# Altium schematic sheet MCU.SchDoc
size A4; SheetNumber: 2; SheetTotal: 10
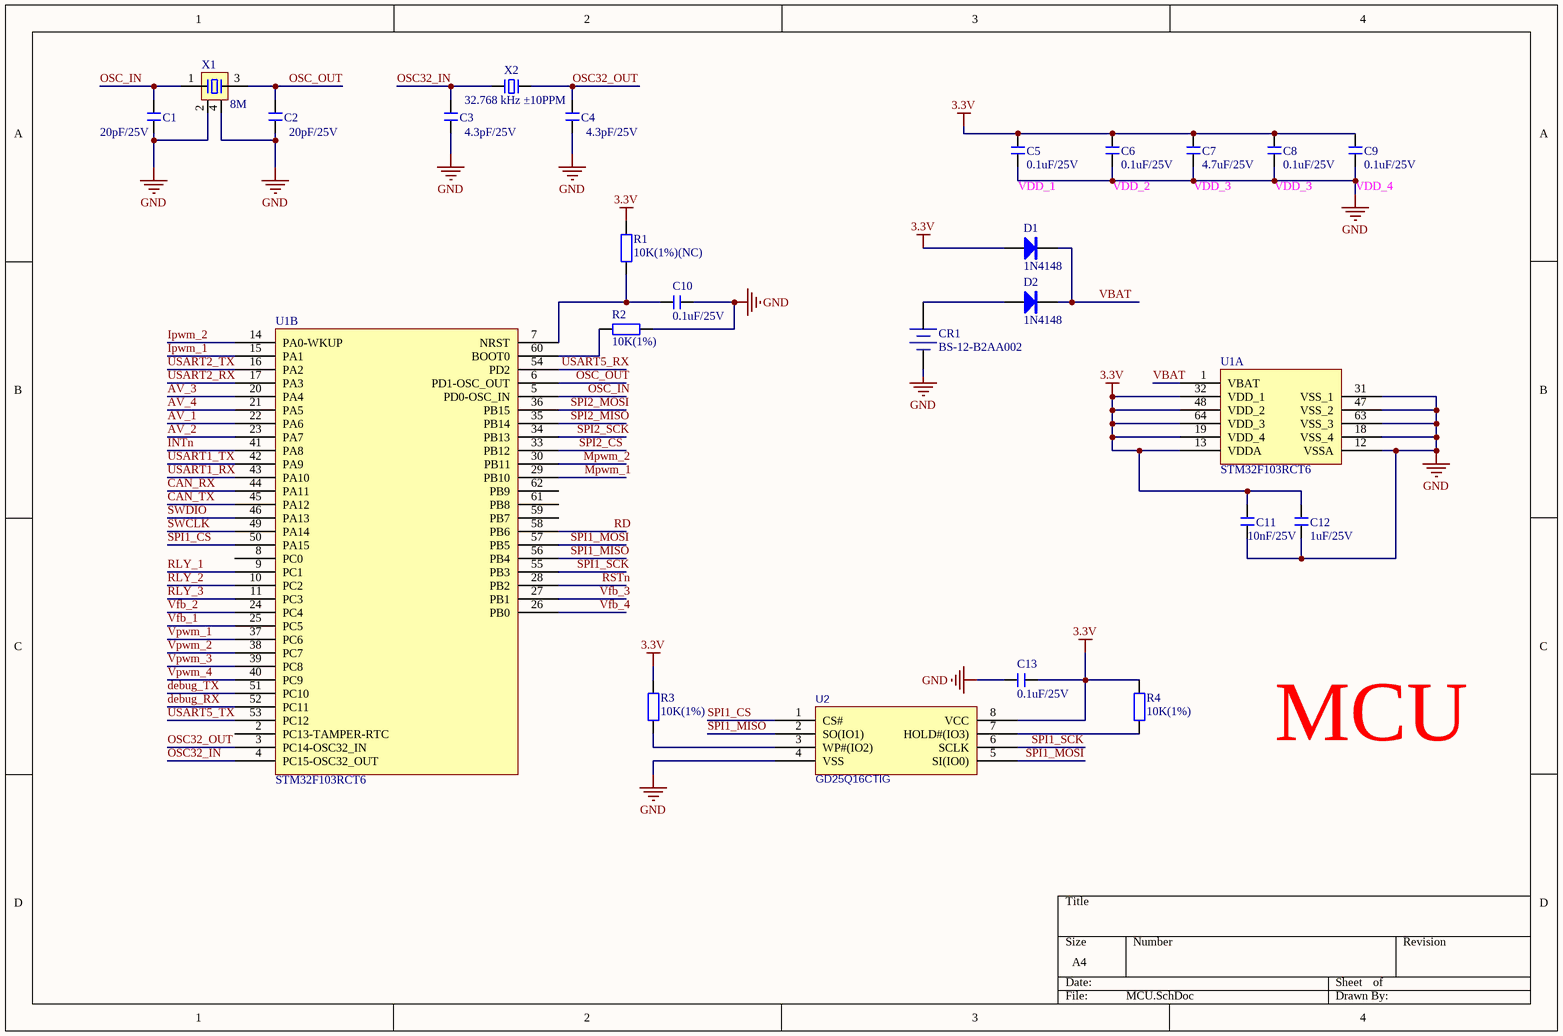
[diagram p0: MCU.SchDoc]

## Parts
C1  20pF/25V  [C 0603_L]
C2  20pF/25V  [C 0603_L]
C3  4.3pF/25V  [C 0603_L]
C4  4.3pF/25V  [C 0603_L]
C5  0.1uF/25V  [C 0603_L]
C6  0.1uF/25V  [C 0603_L]
C7  4.7uF/25V  [C 0603_L]
C8  0.1uF/25V  [C 0603_L]
C9  0.1uF/25V  [C 0603_L]
C10  0.1uF/25V  [C 0603_L]
C11  10nF/25V  [C 0603_L]
C12  1uF/25V  [C 0603_L]
C13  0.1uF/25V  [C 0603_L]
CR1  BS-12-B2AA002  [CR1220_B]
D1  1N4148  [SOD-323]
D2  1N4148  [SOD-323]
R1  10K(1%)(NC)  [R 0603_L]
R2  10K(1%)  [R 0603_L]
R3  10K(1%)  [R 0603_L]
R4  10K(1%)  [R 0603_L]
U1  STM32F103RCT6  [LQFP64 10x10_N]  (parts A,B of 2)
U2  GD25Q16CTIG  [SOP-8]
X1  8M  [OSC 3225-4P]
X2  32.768 kHz ±10PPM  [OSC 3215-2P]

## Nets
3.3V: C5.2 C6.2 C7.2 C8.2 C9.2 C11.1 C12.1 C13.2 D1.1(A) R1.2 R3.1 R4.1 U1.13(VDDA) U1.19(VDD_4) U1.32(VDD_1) U1.48(VDD_2) U1.64(VDD_3) U2.8(VCC)
GND: C1.2 C2.2 C3.2 C4.2 C5.1 C6.1 C7.1 C8.1 C9.1 C10.1 C11.2 C12.2 C13.1 CR1.2(DC-) R2.1 U1.12(VSSA) U1.18(VSS_4) U1.31(VSS_1) U1.47(VSS_2) U1.63(VSS_3) U2.4(VSS) X1.2 X1.4
AV_1: U1.22(PA6)
AV_2: U1.23(PA7)
AV_3: U1.20(PA4)
AV_4: U1.21(PA5)
CAN_RX: U1.44(PA11)
CAN_TX: U1.45(PA12)
debug_RX: U1.52(PC11)
debug_TX: U1.51(PC10)
INTn: U1.41(PA8)
Ipwm_1: U1.15(PA1)
Ipwm_2: U1.14(PA0-WKUP)
Mpwm_1: U1.29(PB10)
Mpwm_2: U1.30(PB11)
OSC32_IN: C3.1 U1.4(PC15-OSC32_OUT) X2.1
OSC32_OUT: C4.1 U1.3(PC14-OSC32_IN) X2.2
OSC_IN: C1.1 U1.5(PD0-OSC_IN) X1.1
OSC_OUT: C2.1 U1.6(PD1-OSC_OUT) X1.3
RD: U1.58(PB6)
RLY_1: U1.9(PC1)
RLY_2: U1.10(PC2)
RLY_3: U1.11(PC3)
RSTn: U1.28(PB2)
SPI1_CS: U1.50(PA15) U2.1(CS#)
SPI1_MISO: U1.56(PB4) U2.2(SO(IO1))
SPI1_MOSI: U1.57(PB5) U2.5(SI(IO0))
SPI1_SCK: U1.55(PB3) U2.6(SCLK)
SPI2_CS: U1.33(PB12)
SPI2_MISO: U1.35(PB14)
SPI2_MOSI: U1.36(PB15)
SPI2_SCK: U1.34(PB13)
SWCLK: U1.49(PA14)
SWDIO: U1.46(PA13)
USART1_RX: U1.43(PA10)
USART1_TX: U1.42(PA9)
USART2_RX: U1.17(PA3)
USART2_TX: U1.16(PA2)
USART5_RX: U1.54(PD2)
USART5_TX: U1.53(PC12)
VBAT: D1.2(K) D2.2(K) U1.1(VBAT)
Vfb_1: U1.25(PC5)
Vfb_2: U1.24(PC4)
Vfb_3: U1.27(PB1)
Vfb_4: U1.26(PB0)
Vpwm_1: U1.37(PC6)
Vpwm_2: U1.38(PC7)
Vpwm_3: U1.39(PC8)
Vpwm_4: U1.40(PC9)
NetC10_2: C10.2 R1.1 U1.7(NRST)
NetCR1_1: CR1.1(DC+) D2.1(A)
NetR2_2: R2.2 U1.60(BOOT0)
NetR3_2: R3.2 U2.3(WP#(IO2))
NetR4_2: R4.2 U2.7(HOLD#(IO3))

Not connected (* = marked no-connect by the designer): U1 2(PC13-TAMPER-RTC) 8(PC0) 59(PB7) 61(PB8) 62(PB9)

## Notes on the sheet
- (near C5) VDD_1
- (near C6) VDD_2
- (near C7) VDD_3
- (near C8) VDD_3
- (near C9) VDD_4
- MCU

## Library data of the parts
C1-C13 = C: 无极性贴片电容; 版权归属: 源创客; BOM名称: 无极性贴片电容; 学习资源: www.ooocke.com
CR1 = CR-3V: MYOUNG(美阳) 电池底座 适用电池:CR1220; BOM名称: 微型电池; 版权归属: 源创客; 学习资源: www.ooocke.com
D1 D2 = 1N4148: 高速开关二极管; 版权归属: 源创客; BOM名称: 高速开关二极管; 学习资源: www.ooocke.com
R1-R4 = R: 贴片电阻; 版权归属: 源创客; BOM名称: 贴片电阻; 学习资源: www.ooocke.com
U2 = GD25Q16CTIG: spi flash; BOM_Manufacturer: XTX; BOM_Manufacturer Part: XT25F32BSOIGU-S; Contributor: LCSC; BOM_Supplier: LCSC; BOM_Supplier Part: C558851; BOM_JLCPCB Part Class: Extended Part; spicePre: U; spiceSymbolName: XT25F32BSOIGU-S
X1 = XTAL-4P: 4脚无源晶振; 版权归属: 源创客; BOM名称: 4脚无源晶振; 学习资源: www.ooocke.com
X2 = XTAL-2P: 2脚无源脚晶振 型号Q13FC13500005; 版权归属: 源创客; BOM名称: 2脚无源脚晶振; 学习资源: www.ooocke.com